# Altium project UWB-Dev-Board.PrjPcb
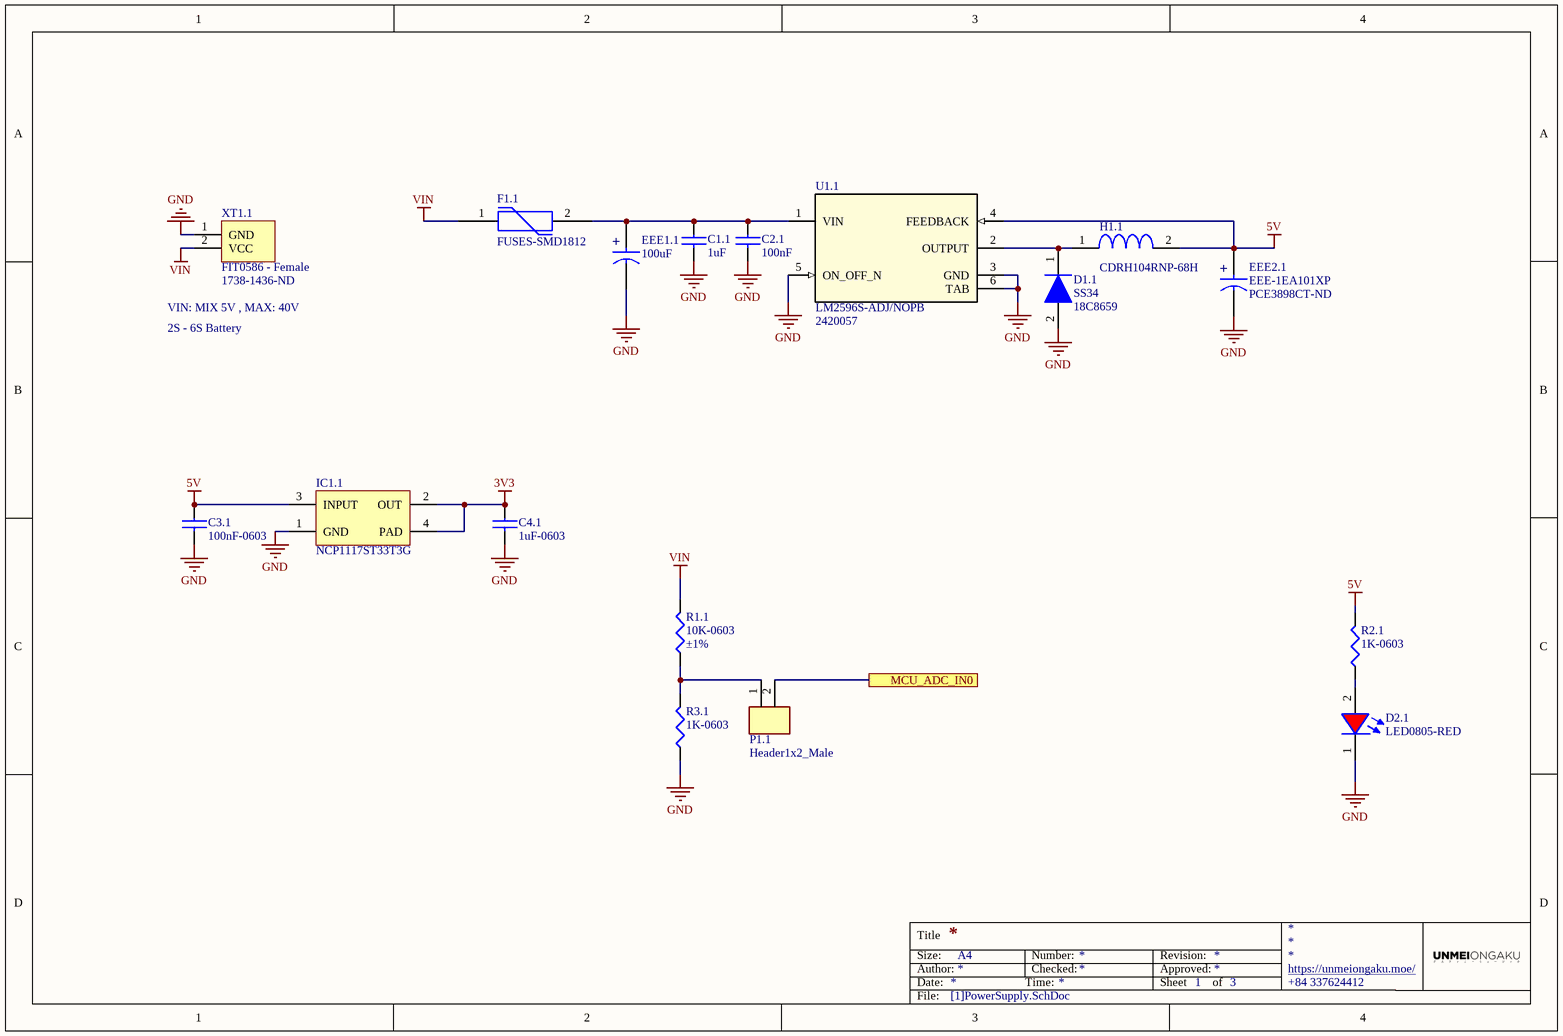
[diagram p0: [1]PowerSupply.SchDoc]
3 sheets, 76 parts. Net scope: flat (ports and power ports of the same name join across sheets).
Board file: UWB-Anchor-DevBoard.PcbDoc
Sheets:
  [1]PowerSupply.SchDoc
  [2] MicroController.SchDoc
  [3] Sensors.SchDoc

## Sheet [1]PowerSupply.SchDoc
size A4; SheetNumber: 1; SheetTotal: 3

### Parts
C1.1  1uF  [CAP0603]
C2.1  100nF  [CAP0603]
C3.1  100nF-0603  [CAP0603]
C4.1  1uF-0603  [CAP0603]
D1.1  SS34  Supplier Part Number 1: 18C8659  [SS34 - 1N5822 / DO-214AA, SMA]
D2.1  LED0805-RED  [LED0805-RED]
EEE1.1  100uF  [CAPACITOR/ALU - SIZE D/SMD - 6.3X5.4]
EEE2.1  EEE-1EA101XP  Supplier Part Number 1: PCE3898CT-ND  [CAPACITOR/ALU - SIZE D8/SMD - 6.3X7.7]
F1.1  FUSES-SMD1812  [FUSES - SMD1812]
H1.1  CDRH104RNP-68H  [CDRH104RNP]
IC1.1  NCP1117ST33T3G  [SOT223-4M_AMS1117_3V3]
P1.1  Header1x2_Male  [HDR1x2_2.54_MALE]
R1.1  10K-0603  Tolerance: ±1%  [RES0603 - 3D]
R2.1  1K-0603  [RES0603 - 3D]
R3.1  1K-0603  [RES0603 - 3D]
U1.1  LM2596S-ADJ/NOPB  Supplier Part Number 1: 2420057  [TO265-5]
XT1.1  FIT0586 - Female  Supplier Part Number 1: 1738-1436-ND  [XT30U-M]

### Ports
MCU_ADC_IN0

### Nets
3V3: C4.1.1 IC1.1.2(OUT) IC1.1.4(PAD)
5V: C3.1.1 EEE2.1.1 H1.1.2 IC1.1.3(INPUT) R2.1.2 U1.1.4(FEEDBACK)
GND: C1.1.2 C2.1.2 C3.1.2 C4.1.2 D1.1.2 D2.1.1(+) EEE1.1.2 EEE2.1.2 IC1.1.1(GND) R3.1.1 U1.1.3(GND) U1.1.5(ON_OFF_N) U1.1.6(TAB) XT1.1.1(GND)
VIN: F1.1.1 R1.1.2 XT1.1.2(VCC)
NetC1.1_1: C1.1.1 C2.1.1 EEE1.1.1 F1.1.2 U1.1.1(VIN)
NetD1.1_1: D1.1.1 H1.1.1 U1.1.2(OUTPUT)
NetD2.1_2: D2.1.2(+) R2.1.1
NetP1.1_1: P1.1.1 R1.1.1 R3.1.2
NetP1.1_2: P1.1.2 ; port MCU_ADC_IN0

### Notes on the sheet
- VIN: MIX 5V , MAX: 40V
- 2S - 6S Battery
- Title
- Size:
- Date:
- Author:
- A4
- Time:
- Number:
- Checked:
- Revision:
- Sheet
- Approved:
- of
- https://unmeiongaku.moe/
- +84 337624412
- File:
- (in symbol EEE-1AA101SP) +
- (in symbol EEE-1EA101XP) +

### Library data of the parts
C1.1 C4.1 = CC0603KRX7R7BB105: CAP CER 1UF 16V X7R 0603; Manufacturer 1: Yageo; Category 1: Capacitors; Capacitance: 1µF; Tolerance: ±10%; Supplier 1: Digi-Key; Supplier Part Number 1: 311-1446-1-ND; Manufacturer Part Number 1: CC0603KRX7R7BB105; RoHS 1: RoHS Compliant; Description 1: CAP CER 1UF 16V X7R 0603; Stock 1: 274580; Pricing 1: 1=0.1, 10=0.051, 100=0.0227, 500=0.0162, 1000=0.01274 (USD); Packaging: Cut Tape (CT); Part Status: Active; Voltage - Rated: 16V; Temperature Coefficient: X7R; Operating Temperature: -55°C ~ 125°C; Features: -; Ratings: -; Applications: General Purpose; Failure Rate: -; Mounting Type: Surface Mount, MLCC; Package / Case: 0603 (1608 Metric); Size / Dimension: 0.063" L x 0.031" W (1.60mm x 0.80mm); Height - Seated (Max): -; Thickness (Max): 0.035" (0.90mm); Lead Spacing: -; Lead Style: -; ComponentLink1URL: http://www.yageo.com/documents/recent/UPY-GPHC_X7R_6.3V-to-50V_18.pdf; ComponentLink1Description: http://www.yageo.com/documents/recent/UPY-GPHC_X7R_6.3V-to-50V_18.pdf; Value: 1uF
C2.1 = CC0603KRX7R9BB104: CAP CER 0.1UF 50V X7R 0603; Manufacturer 1: Yageo; Category 1: Capacitors; Capacitance: 0.1µF; Tolerance: ±10%; Supplier 1: Digi-Key; Supplier Part Number 1: 311-1344-1-ND; Manufacturer Part Number 1: CC0603KRX7R9BB104; RoHS 1: RoHS Compliant; Description 1: CAP CER 0.1UF 50V X7R 0603; Stock 1: 4411645; Pricing 1: 1=0.1, 10=0.031, 100=0.014, 500=0.00998, 1000=0.00783 (USD); Packaging: Cut Tape (CT); Part Status: Active; Voltage - Rated: 50V; Temperature Coefficient: X7R; Operating Temperature: -55°C ~ 125°C; Features: -; Ratings: -; Applications: General Purpose; Failure Rate: -; Mounting Type: Surface Mount, MLCC; Package / Case: 0603 (1608 Metric); Size / Dimension: 0.063" L x 0.031" W (1.60mm x 0.80mm); Height - Seated (Max): -; Thickness (Max): 0.035" (0.90mm); Lead Spacing: -; Lead Style: -; ComponentLink1URL: http://www.yageo.com/documents/recent/UPY-GPHC_X7R_6.3V-to-50V_18.pdf; ComponentLink1Description: http://www.yageo.com/documents/recent/UPY-GPHC_X7R_6.3V-to-50V_18.pdf; Value: 100nF
C3.1 = CC0603KRX7R9BB104: CAP CER 0.1UF 50V X7R 0603; Manufacturer 1: Yageo; Category 1: Capacitors; Capacitance: 0.1µF; Tolerance: ±10%; Value: 100nF; Supplier 1: Digi-Key; Supplier Part Number 1: 311-1344-1-ND; Manufacturer Part Number 1: CC0603KRX7R9BB104; RoHS 1: RoHS Compliant; Description 1: CAP CER 0.1UF 50V X7R 0603; Stock 1: 4411645; Pricing 1: 1=0.1, 10=0.031, 100=0.014, 500=0.00998, 1000=0.00783 (USD); Packaging: Cut Tape (CT); Part Status: Active; Voltage - Rated: 50V; Temperature Coefficient: X7R; Operating Temperature: -55°C ~ 125°C; Features: -; Ratings: -; Applications: General Purpose; Failure Rate: -; Mounting Type: Surface Mount, MLCC; Package / Case: 0603 (1608 Metric); Size / Dimension: 0.063" L x 0.031" W (1.60mm x 0.80mm); Height - Seated (Max): -; Thickness (Max): 0.035" (0.90mm); Lead Spacing: -; Lead Style: -; ComponentLink1URL: http://www.yageo.com/documents/recent/UPY-GPHC_X7R_6.3V-to-50V_18.pdf; ComponentLink1Description: http://www.yageo.com/documents/recent/UPY-GPHC_X7R_6.3V-to-50V_18.pdf
D1.1 = SS34: SS Series 500 mV 3 A 40 V Max Reverse Voltage Schottky Rectifier - DO-214AB; Manufacturer: ON Semiconductor / Fairchild; Number of Terminals/Pins: 2; Package Body Material: Plastic; Diode Element Material: SILICON; Forward Current: 3A; Element Configuration: Single; Max Repetitive Reverse Voltage (Vrrm): 40V; Forward Voltage: 500mV; Max Forward Surge Current (Ifsm): 100A; Polarity: Standard; Max Reverse Current: 500uA; Number of Elements: 1; Max Power Dissipation: 2.27W; Supplier 1: Newark; Manufacturer Part Number: SS34; RoHS: Yes; Category: Schottky Diodes; Stock 1: 7040; Pricing 1: 1=0.65000, 25=0.57600, 50=0.50900, 100=0.44100, 250=0.39500, 500=0.34900, 1000=0.27900 (USD); Mount: Surface Mount; Case/Package: SMC; Number of Pins: 2; Contact Plating: Tin,Matte; Package Shape: Rectangular; Terminal Finish: Tin; Min Operating Temperature: -55°C; Max Operating Temperature: 150°C; Packaging: Tape and Reel; Voltage Rating (DC): 40V; Current Rating: 3A; Output Current: 3A; Max Surge Current: 100A; Package Quantity: 1; Max Reverse Leakage Current: 500uA; Peak Non-Repetitive Surge Current: 100A; Current: 3A; Voltage: 40V; Average Rectified Current: 3A; Max Reverse Voltage (DC): 40V; Series: -; Moisture Sensitivity Level: 1; JESD-30 Code: R-PDSO-C2; Peak Reflow Temperature (Cel): 260°C; Surface Mount: Yes; Terminal Position: DUAL; Technology: SCHOTTKY; Number of Phases: 1; Terminal Form: C BEND; Length: 7.15mm; Width: 6.25mm; Height: 2.75mm; Radiation Hardening: No; RoHS Compliant: Yes; Reach SVHC Compliant: Yes; Lead Free: Lead Free; JEDEC-95 Code: DO-214AB
EEE1.1 = EEE-1AA101SP: Cap Aluminum 100uF 10V 20% (6.3 X 5.4mm) SMD 70mA 2000 hr 85°C T/R; Manufacturer: Panasonic; Polarity: Polar; Life (Hours): 2000Hour; Leakage Current: 3uA; Supplier 1: Digi-Key; Manufacturer Part Number: EEE-1AA101SP; RoHS: Yes; Category: Aluminum Electrolytic Capacitors; Pricing 1: 1=0.38000, 10=0.26400, 50=0.18520, 100=0.15870, 500=0.11902 (USD); Mount: Surface Mount,PCB; Case/Package: Radial; Contact Plating: Tin; Min Operating Temperature: -40°C; Max Operating Temperature: 85°C; Packaging: Tape and Reel; Capacitance: 100uF; Tolerance: 20%; Ripple Current: 70mA; Voltage Rating: 10V; Package Quantity: 1000; Voltage Rating (DC): 10V; Termination: SMD/SMT; Ripple Current (AC): 70mA; Voltage: 10V; Features: General Purpose; Series: S; Construction: Cylindrical; Diameter: 6.3mm; Length: 5.5mm; Height: 5.4mm; Height - Seated (Max): 0.213inch; Radiation Hardening: No; Lead Free: Lead Free; RoHS Compliant: Yes; REACH SVHC: Unknown; ComponentLink1URL: https://datasheet.ciiva.com/43470/aba0000ce2-43470621.pdf?src-supplier=Farnell; ComponentLink1Description: https://datasheet.ciiva.com/43470/aba0000ce2-43470621.pdf?src-supplier=Farnell; ComponentLink2URL: https://datasheet.ciiva.com/46378/aba0000ce2-46378266.pdf?src-supplier=Element14; ComponentLink2Description: https://datasheet.ciiva.com/46378/aba0000ce2-46378266.pdf?src-supplier=Element14; ComponentLink3URL: https://datasheet.ciiva.com/31414/aba0000ce2-31414629.pdf?src-supplier=Farnell; ComponentLink3Description: https://datasheet.ciiva.com/31414/aba0000ce2-31414629.pdf?src-supplier=Farnell; ComponentLink4URL: https://datasheet.ciiva.com/46374/aba0000ce2-46374349.pdf?src-supplier=Element14; ComponentLink4Description: https://datasheet.ciiva.com/46374/aba0000ce2-46374349.pdf?src-supplier=Element14; ComponentLink5URL: https://datasheet.ciiva.com/14598/70255710-14598444.pdf?src-supplier=Allied+Electronics; ComponentLink5Description: https://datasheet.ciiva.com/14598/70255710-14598444.pdf?src-supplier=Allied+Electronics; ComponentLink6URL: https://datasheet.ciiva.com/14604/70255710-14604862.pdf?src-supplier=Allied+Electronics; ComponentLink6Description: https://datasheet.ciiva.com/14604/70255710-14604862.pdf?src-supplier=Allied+Electronics; ComponentLink7URL: https://datasheet.ciiva.com/2983/aba0000ce2-2983905.pdf?src-supplier=Avnet; ComponentLink7Description: https://datasheet.ciiva.com/2983/aba0000ce2-2983905.pdf?src-supplier=Avnet; ComponentLink8URL: https://datasheet.ciiva.com/15166/getdatasheetpartid-178534-15166250.pdf?src-supplier=Verical; ComponentLink8Description: https://datasheet.ciiva.com/15166/getdatasheetpartid-178534-15166250.pdf?src-supplier=Verical; ComponentLink9URL: https://datasheet.ciiva.com/2985/aba0000ce2-2985040.pdf?src-supplier=Avnet; ComponentLink9Description: https://datasheet.ciiva.com/2985/aba0000ce2-2985040.pdf?src-supplier=Avnet; ComponentLink10URL: https://datasheet.ciiva.com/30099/11aba0000ce2-30099766.pdf?src-supplier=Onlinecomponents.com; ComponentLink10Description: https://datasheet.ciiva.com/30099/11aba0000ce2-30099766.pdf?src-supplier=Onlinecomponents.com; ComponentLink11URL: https://datasheet.ciiva.com/17536/aba0000ce2-17536070.pdf?src-supplier=Avnet+Europe; ComponentLink11Description: https://datasheet.ciiva.com/17536/aba0000ce2-17536070.pdf?src-supplier=Avnet+Europe; Supplier Part Number 1: PCE3866DKR-ND
EEE2.1 = EEE-1EA101XP: Cap Aluminum 100uF 25V 20% (6.3 X 7.7mm) SMD 143mA 2000h 85°C T/R; Manufacturer: Panasonic; Polarity: Polar; Life (Hours): 2000Hour; Leakage Current: 3uA; Supplier 1: Digi-Key; Manufacturer Part Number: EEE-1EA101XP; RoHS: Yes; Category: Aluminum Electrolytic Capacitors; Pricing 1: 1=0.52000, 10=0.36100, 50=0.25240, 100=0.21630 (USD); Mount: Surface Mount,PCB; Case/Package: Radial; Contact Plating: Tin; Min Operating Temperature: -40°C; Max Operating Temperature: 85°C; Capacitance: 100uF; Tolerance: 20%; Voltage Rating (DC): 25V; Ripple Current: 143mA; Packaging: Tape and Reel; Voltage Rating: 25V; Package Quantity: 900; Termination: SMD/SMT; Ripple Current (AC): 143mA; Voltage: 25V; Series: S; Construction: Cylindrical; Diameter: 6.3mm; Length: 8mm; Height: 7.7mm; Height - Seated (Max): 0.303inch; Radiation Hardening: No; Lead Free: Lead Free; RoHS Compliant: Yes; REACH SVHC: Unknown; ComponentLink1URL: https://datasheet.ciiva.com/24022/aba0000ce2-40801-24022875.pdf?src-supplier=Mouser; ComponentLink1Description: https://datasheet.ciiva.com/24022/aba0000ce2-40801-24022875.pdf?src-supplier=Mouser; ComponentLink2URL: https://datasheet.ciiva.com/16201/aba0000ce2-16201065.pdf?src-supplier=Future+Electronics; ComponentLink2Description: https://datasheet.ciiva.com/16201/aba0000ce2-16201065.pdf?src-supplier=Future+Electronics; ComponentLink3URL: https://datasheet.ciiva.com/30108/11aba0000ce2-30108047.pdf?src-supplier=Onlinecomponents.com; ComponentLink3Description: https://datasheet.ciiva.com/30108/11aba0000ce2-30108047.pdf?src-supplier=Onlinecomponents.com; ComponentLink4URL: https://datasheet.ciiva.com/17529/aba0000ce2-17529557.pdf?src-supplier=Avnet+Europe; ComponentLink4Description: https://datasheet.ciiva.com/17529/aba0000ce2-17529557.pdf?src-supplier=Avnet+Europe
H1.1 = CDRH104RNP-680NC: Ind Power Shielded Wirewound 68uH 30% 100KHz Ferrite 1.42A Carrier T/R; Manufacturer: Sumida; Saturation Current: 1.5A; DC Resistance (DCR): 213mR; Supplier 1: Digi-Key; Manufacturer Part Number: CDRH104RNP-680NC; RoHS: Yes; Category: Fixed Inductors; Stock 1: 26557; Pricing 1: 1=1.78000, 10=1.64700, 25=1.51000, 50=1.29060, 100=1.15320, 250=0.98848, 500=0.93356 (USD); Mount: Surface Mount; Case/Package: Nonstandard; Core Material: Ferrite; Min Operating Temperature: -40°C; Max Operating Temperature: 100°C; Package Quantity: 1000; Current Rating: 1.42A; Tolerance: 30%; Shielding: Shielded; Packaging: Tape and Reel; Inductance: 68uH; Test Frequency: 100kHz; Max DC Current: 1.42A; Termination: SMD/SMT; Series: CDRH; Rated Current-Max: 1.5A; Length: 0.402inch; Width: 0.405inch; Height: 4mm; Height - Seated (Max): 0.157inch; Depth: 10.3mm; Radiation Hardening: No; Lead Free: Lead Free; RoHS Compliant: Yes; ComponentLink1URL: http://www.sumida.com/products/pdf/CDRH104,104R.pdf?src-supplier=Digi-Key; ComponentLink1Description: http://www.sumida.com/products/pdf/CDRH104,104R.pdf?src-supplier=Digi-Key; ComponentLink2URL: http://products.sumida.com/products/pdf/CDRH104R.pdf?src-supplier=Digi-Key; ComponentLink2Description: http://products.sumida.com/products/pdf/CDRH104R.pdf?src-supplier=Digi-Key; ComponentLink3URL: http://www.sumida.com/products/pdf/CDRH104,104R.pdf?src-supplier=Mouser; ComponentLink3Description: http://www.sumida.com/products/pdf/CDRH104,104R.pdf?src-supplier=Mouser; ComponentLink4URL: http://www.sumida.com/products/pdf/CDRH104R.pdf?src-supplier=Avnet; ComponentLink4Description: http://www.sumida.com/products/pdf/CDRH104R.pdf?src-supplier=Avnet; ComponentLink5URL: http://www.sumida.com/products/pdf/CDRH104,104R.pdf?src-supplier=Future+Electronics; ComponentLink5Description: http://www.sumida.com/products/pdf/CDRH104,104R.pdf?src-supplier=Future+Electronics; Supplier Part Number 1: 308-2170-1-ND
IC1.1 = AMS1117 - 3V3: LDO Voltage Regulators 3.3V 1A Positive; Manufacturer: ON Semiconductor; Input Voltage MAX: 20 V; Number of Outputs: 1 Output; Output Type: Fixed; Quiescent Current: 10 mA; Dropout Voltage - Max: 1.1 V at 100 mA; Voltage Regulation Accuracy: 1 %; Dropout Voltage: 0.95 V at 100 mA; Ib - Input Bias Current: 6 mA; Line Regulation: 0.8 mV; Load Regulation: 4.3 mV; Supplier 1: Mouser; Manufacturer Part Number: NCP1117ST33T3G; RoHS: RoHS Compliant; Category: LDO Voltage Regulators; Stock 1: 0; Pricing 1: 1=0.450, 10=0.366, 100=0.223, 1000=0.173, 4000=0.147, 8000=0.137, 24000=0.130, 48000=0.127 (USD); Height: 1.69 mm (Max); Length: 6.7 mm (Max); Output Current: 1 A; Output Voltage: 3.3 V; Package / Case: SOT-223-3; Packaging: Cut Tape; Series: NCP1117; Width: 3.7 mm (Max); Brand: ON Semiconductor; Mounting Style: SMD/SMT; Maximum Operating Temperature: + 125 C; Minimum Operating Temperature: 0 C; Polarity: Positive; Standard Pack Qty: 4000; RoHS - Mouser: Y; Minimum Order Quantity: 1; Reeling: True; ComponentLink1URL: https://www.mouser.com/ds/2/308/NCP1117-D-81326.pdf; ComponentLink1Description: https://www.mouser.com/ds/2/308/NCP1117-D-81326.pdf; Supplier Part Number 1: 863-NCP1117ST33T3G
P1.1 = HDR1x2_2.54_MALE: Header1x2_2.54_MALE
R1.1 = RC0603FR-0710KL: RES SMD 10K OHM 1% 1/10W 0603; Manufacturer: Yageo; Power (Watts): 0.1W, 1/10W; Temperature Coefficient: ±100ppm/°C; Supplier 1: Digi-Key; Manufacturer Part Number: RC0603FR-0710KL; RoHS: RoHS Compliant; Category: Resistors; Stock 1: 16545228; Pricing 1: 1=0.1, 10=0.015, 100=0.006, 1000=0.00268, 2500=0.00233 (USD); Packaging: Cut Tape (CT); Part Status: Active; Composition: Thick Film; Features: Moisture Resistant; Operating Temperature: -55°C ~ 155°C; Package / Case: 0603 (1608 Metric); Supplier Device Package: 0603; Size / Dimension: 0.063" L x 0.032" W (1.60mm x 0.80mm); Height - Seated (Max): 0.022" (0.55mm); Failure Rate: -; ComponentLink1URL: http://www.yageo.com/documents/recent/PYu-RC_Group_51_RoHS_L_7.pdf; ComponentLink1Description: http://www.yageo.com/documents/recent/PYu-RC_Group_51_RoHS_L_7.pdf; Supplier Part Number 1: 311-10.0KHRCT-ND; Value: 10K
R2.1 R3.1 = RC0603JR-071KL: RES SMD 1K OHM 5% 1/10W 0603; Manufacturer 1: Yageo; Category 1: Resistors; Power (Watts): 0.1W, 1/10W; Temperature Coefficient: ±100ppm/°C; Supplier 1: Digi-Key; Supplier Part Number 1: 311-1.0KGRCT-ND; Manufacturer Part Number 1: RC0603JR-071KL; RoHS 1: RoHS Compliant; Description 1: RES SMD 1K OHM 5% 1/10W 0603; Stock 1: 2853955; Pricing 1: 1=0.1, 10=0.011, 100=0.0044, 1000=0.00198, 2500=0.00172 (USD); Packaging: Cut Tape (CT); Part Status: Active; Resistance (Ohms): 1k; Tolerance: ±5%; Composition: Thick Film; Features: Moisture Resistant; Operating Temperature: -55°C ~ 155°C; Package / Case: 0603 (1608 Metric); Supplier Device Package: 0603; Size / Dimension: 0.063" L x 0.031" W (1.60mm x 0.80mm); Height - Seated (Max): 0.022" (0.55mm); Failure Rate: -; ComponentLink1URL: http://www.yageo.com/documents/recent/PYu-RC_Group_51_RoHS_L_7.pdf; ComponentLink1Description: http://www.yageo.com/documents/recent/PYu-RC_Group_51_RoHS_L_7.pdf; Value: 1K
U1.1 = LM2596S-ADJ/NOPB: Optoisolator 5KV Trans 4SMD / Optocoupler Dc-in 1-CH Transistor Dc-out 4-PIN PDIP SMD; Mfr_Name: Texas Instruments; PartNumber: LM2596SX-ADJ/NOPB; Manufacturer Part Number: PC817XNNIP0F; CompType: IC; Reverse Breakdown Voltage: 6V; Forward Voltage: 1.4V; Forward Current: 50mA; Rise Time: 18000ns; Collector Emitter Voltage (VCEO): 80V; Collector Emitter Saturation Voltage: 200mV; Number of Elements: 1; Power Dissipation: 200mW; Input Type: DC; Output Current per Channel: 30mA; Type: DEV; RefDes: RefDes; Copyright: Copyright (C) 2021 Ultra Librarian. All rights reserved.; Manufacturer_Part_Number: LM2596S-ADJ/NOPB; Alternate_PartNumber: LM2596S-ADJ/NOPB; PackageReference: KTT0005B; MountType: SMT; RoHS: Y; Manufacturer: Texas Instruments; Supplier 1: Farnell; Category: Optocouplers; Pricing 1: 1=0.31700, 25=0.29900, 100=0.21300, 250=0.17700, 500=0.14100, 2000=0.13800 (GBP); Mount: Surface Mount; Case/Package: SMD/SMT; Number of Pins: 4; Contact Plating: Copper,Tin; Min Operating Temperature: -30°C; Max Operating Temperature: 100°C; Fall Time: 18000ns; Packaging: Tape and Reel; Max Power Dissipation: 200mW; Package Quantity: 2000; Number of Channels: 1; Output Voltage: 80V; Max Input Current: 50mA; Max Collector Current: 50mA; Isolation Voltage: 5kV; Input Current: 50mA; Collector-emitter Voltage-Max: 200mV; Max Output Voltage: 80V; Isolation Voltage-Max: 5kV; Radiation Hardening: No; RoHS Compliant: Yes; Lead Free: Lead Free; ComponentLink1URL: https://datasheet.ciiva.com/15119/getdatasheetpartid-299374-15119023.pdf?src-supplier=Verical; ComponentLink1Description: https://datasheet.ciiva.com/15119/getdatasheetpartid-299374-15119023.pdf?src-supplier=Verical; ComponentLink2URL: https://datasheet.ciiva.com/2086/pc817xxnip0f-series-2086508.pdf?src-supplier=Digi-Key; ComponentLink2Description: https://datasheet.ciiva.com/2086/pc817xxnip0f-series-2086508.pdf?src-supplier=Digi-Key; ComponentLink3URL: https://datasheet.ciiva.com/2086/pc817xxnip0f-series-2086507.pdf?src-supplier=Digi-Key; ComponentLink3Description: https://datasheet.ciiva.com/2086/pc817xxnip0f-series-2086507.pdf?src-supplier=Digi-Key; ComponentLink4URL: https://datasheet.ciiva.com/2086/pc817xxnip0f-series-2086509.pdf?src-supplier=Digi-Key; ComponentLink4Description: https://datasheet.ciiva.com/2086/pc817xxnip0f-series-2086509.pdf?src-supplier=Digi-Key; ComponentLink5URL: https://datasheet.ciiva.com/46396/1812378-46396954.pdf?src-supplier=Element14; ComponentLink5Description: https://datasheet.ciiva.com/46396/1812378-46396954.pdf?src-supplier=Element14; ComponentLink6URL: https://datasheet.ciiva.com/46435/1812378-46435723.pdf?src-supplier=Element14; ComponentLink6Description: https://datasheet.ciiva.com/46435/1812378-46435723.pdf?src-supplier=Element14; ComponentLink7URL: https://datasheet.ciiva.com/16475/pc817xnnip0f-16475911.pdf?src-supplier=Future+Electronics; ComponentLink7Description: https://datasheet.ciiva.com/16475/pc817xnnip0f-16475911.pdf?src-supplier=Future+Electronics
XT1.1 = FIT0586 - Female: High Quality Gold Plated Male and Female Bullet Connector; Manufacturer: DFRobot; Supplier 1: Digikey; Manufacturer Part Number: FIT0586; RoHS: No; Category: Uncategorized; Stock 1: 818; Pricing 1: 1=1.9 (USD); ComponentLink1URL: https://media.digikey.com/pdf/Data%20Sheets/DFRobot%20PDFs/FIT0586_Web.pdf?src-supplier=Digikey; ComponentLink1Description: https://media.digikey.com/pdf/Data%20Sheets/DFRobot%20PDFs/FIT0586_Web.pdf?src-supplier=Digikey

## Sheet [2] MicroController.SchDoc
size A4; SheetNumber: 2; SheetTotal: 3
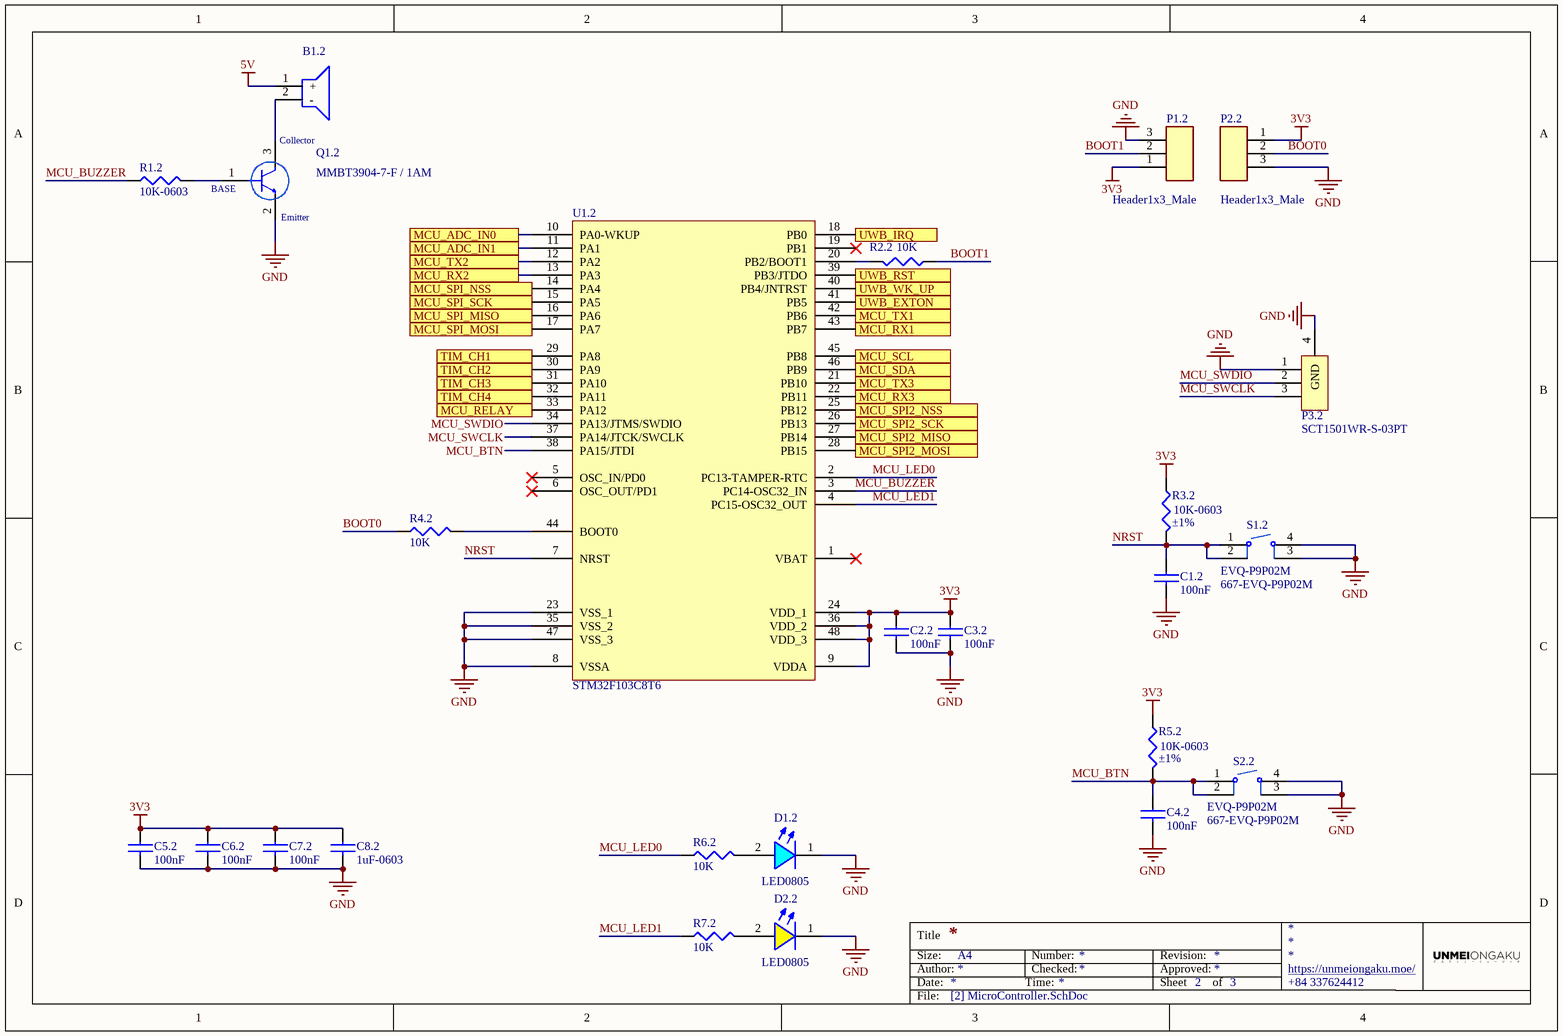
[diagram p1: [2] MicroController.SchDoc]

### Parts
B1.2  Buzzer  [Buzzer 9x5mm 60dB]  (value not drawn)
C1.2  100nF  [CAP0603]
C2.2  100nF  [CAP0603]
C3.2  100nF  [CAP0603]
C4.2  100nF  [CAP0603]
C5.2  100nF  [CAP0603]
C6.2  100nF  [CAP0603]
C7.2  100nF  [CAP0603]
C8.2  1uF-0603  [CAP0603]
D1.2  LED0805  [LED0805-BLUE]
D2.2  LED0805  [LED0805-YELLOW]
P1.2  Header1x3_Male  [HDR1x3_2.54_MALE]
P2.2  Header1x3_Male  [HDR1x3_2.54_MALE]
P3.2  SCT1501WR-S-03PT  [Connector ZH1.5 3P SMD]
Q1.2  MMBT3904-7-F / 1AM  [SOT23]
R1.2  10K-0603  [RES0603 - 3D]
R2.2  10K  [RES0603 - 3D]
R3.2  10K-0603  Tolerance: ±1%  [RES0603 - 3D]
R4.2  10K  [RES0603 - 3D]
R5.2  10K-0603  Tolerance: ±1%  [RES0603 - 3D]
R6.2  10K  [RES0603 - 3D]
R7.2  10K  [RES0603 - 3D]
S1.2  EVQ-P9P02M  Supplier Part Number 1: 667-EVQ-P9P02M  [TactileSwitch,SMT,4.2x3.2x2.5mm,4N]
S2.2  EVQ-P9P02M  Supplier Part Number 1: 667-EVQ-P9P02M  [TactileSwitch,SMT,4.2x3.2x2.5mm,4N]
U1.2  STM32F103C8T6  [LQFP48_L]

### Ports
MCU_ADC_IN0, MCU_ADC_IN1, MCU_RELAY, MCU_RX1, MCU_RX2, MCU_RX3, MCU_SCL, MCU_SDA, MCU_SPI2_MISO, MCU_SPI2_MOSI, MCU_SPI2_NSS, MCU_SPI2_SCK, MCU_SPI_MISO, MCU_SPI_MOSI, MCU_SPI_NSS, MCU_SPI_SCK, MCU_TX1, MCU_TX2, MCU_TX3, TIM_CH1, TIM_CH2, TIM_CH3, TIM_CH4, UWB_EXTON, UWB_IRQ, UWB_RST, UWB_WK_UP

### Nets
3V3: C2.2.1 C3.2.1 C5.2.1 C6.2.1 C7.2.1 C8.2.1 P1.2.1 P2.2.1 R3.2.1 R5.2.1 U1.2.9(VDDA) U1.2.24(VDD_1) U1.2.36(VDD_2) U1.2.48(VDD_3)
5V: B1.2.1(+)
GND: C1.2.2 C2.2.2 C3.2.2 C4.2.2 C5.2.2 C6.2.2 C7.2.2 C8.2.2 D1.2.1(+) D2.2.1(+) P1.2.3 P2.2.3 P3.2.1 P3.2.4(GND) Q1.2.2 S1.2.3 S1.2.4 S2.2.3 S2.2.4 U1.2.8(VSSA) U1.2.23(VSS_1) U1.2.35(VSS_2) U1.2.47(VSS_3)
BOOT0: P2.2.2 R4.2.1
BOOT1: P1.2.2 R2.2.1
MCU_BTN: C4.2.1 R5.2.2 S2.2.1 S2.2.2 U1.2.38(PA15/JTDI)
MCU_BUZZER: R1.2.1 U1.2.3(PC14-OSC32_IN)
MCU_LED0: R6.2.1 U1.2.2(PC13-TAMPER-RTC)
MCU_LED1: R7.2.1 U1.2.4(PC15-OSC32_OUT)
MCU_SWCLK: P3.2.3 U1.2.37(PA14/JTCK/SWCLK)
MCU_SWDIO: P3.2.2 U1.2.34(PA13/JTMS/SWDIO)
NRST: C1.2.1 R3.2.2 S1.2.1 S1.2.2 U1.2.7(NRST)
NetB1.2_2: B1.2.2(-) Q1.2.3
NetD1.2_2: D1.2.2(+) R6.2.2
NetD2.2_2: D2.2.2(+) R7.2.2
NetIC1.3_5: U1.2.46(PB9) ; port MCU_SDA
NetIC1.3_6: U1.2.45(PB8) ; port MCU_SCL
NetP1.1_2: U1.2.10(PA0-WKUP) ; port MCU_ADC_IN0
NetP1.3_1: U1.2.29(PA8) ; port TIM_CH1
NetP1.3_2: U1.2.30(PA9) ; port TIM_CH2
NetP1.3_3: U1.2.31(PA10) ; port TIM_CH3
NetP1.3_4: U1.2.32(PA11) ; port TIM_CH4
NetP2.3_2: U1.2.21(PB10) ; port MCU_TX3
NetP2.3_3: U1.2.22(PB11) ; port MCU_RX3
NetP3.3_2: U1.2.11(PA1) ; port MCU_ADC_IN1
NetP4.3_2: U1.2.42(PB6) ; port MCU_TX1
NetP4.3_3: U1.2.43(PB7) ; port MCU_RX1
NetP6.3_4: U1.2.33(PA12) ; port MCU_RELAY
NetP7.3_2: U1.2.12(PA2) ; port MCU_TX2
NetP7.3_3: U1.2.13(PA3) ; port MCU_RX2
NetP8.3_1: U1.2.25(PB12) ; port MCU_SPI2_NSS
NetP8.3_2: U1.2.26(PB13) ; port MCU_SPI2_SCK
NetP8.3_3: U1.2.27(PB14) ; port MCU_SPI2_MISO
NetP8.3_4: U1.2.28(PB15) ; port MCU_SPI2_MOSI
NetQ1.2_1: Q1.2.1 R1.2.2
NetR2.2_2: R2.2.2 U1.2.20(PB2/BOOT1)
NetR4.2_2: R4.2.2 U1.2.44(BOOT0)
NetR9.3_2: U1.2.39(PB3/JTDO) ; port UWB_RST
NetR10.3_2: U1.2.40(PB4/JNTRST) ; port UWB_WK_UP
NetR11.3_2: U1.2.41(PB5) ; port UWB_EXTON
NetR12.3_2: U1.2.18(PB0) ; port UWB_IRQ
NetU1.2_14: U1.2.14(PA4) ; port MCU_SPI_NSS
NetU1.2_15: U1.2.15(PA5) ; port MCU_SPI_SCK
NetU1.2_16: U1.2.16(PA6) ; port MCU_SPI_MISO
NetU1.2_17: U1.2.17(PA7) ; port MCU_SPI_MOSI

Not connected (* = marked no-connect by the designer): U1.2 1(VBAT)* 5(OSC_IN/PD0)* 6(OSC_OUT/PD1)* 19(PB1)*

### Notes on the sheet
- Title
- Size:
- Date:
- Author:
- A4
- Time:
- Number:
- Checked:
- Revision:
- Sheet
- Approved:
- of
- https://unmeiongaku.moe/
- +84 337624412
- File:
- (in symbol MMBT3904-7-F / 1AM) Collector; BASE; Emitter

### Library data of the parts
B1.2 = Buzzer 9050 - DIP: 9050 DIP Buzzer 9x5mm 60dB; Local Supplier: thegioiic; Local Supplier Link: https://www.thegioiic.com/products/1209-dip-buzzer-12x9mm; Local Supplier Part Number: 1209 DIP Buzzer 12x9mm
C1.2 C2.2 C3.2 C4.2 C5.2 C6.2 C7.2 = CC0603KRX7R9BB104: as C2.1 on sheet [1]PowerSupply; Supplier 1: Digi-Key; Supplier Part Number 1: 311-1344-1-ND; Manufacturer Part Number 1: CC0603KRX7R9BB104; RoHS 1: RoHS Compliant; Description 1: CAP CER 0.1UF 50V X7R 0603; Stock 1: 4411645; Pricing 1: 1=0.1, 10=0.031, 100=0.014, 500=0.00998, 1000=0.00783 (USD); Packaging: Cut Tape (CT); Part Status: Active; Voltage - Rated: 50V; Temperature Coefficient: X7R; Operating Temperature: -55°C ~ 125°C; Features: -; Ratings: -; Applications: General Purpose; Failure Rate: -; Mounting Type: Surface Mount, MLCC; Package / Case: 0603 (1608 Metric); Size / Dimension: 0.063" L x 0.031" W (1.60mm x 0.80mm); Height - Seated (Max): -; Thickness (Max): 0.035" (0.90mm); Lead Spacing: -; Lead Style: -; ComponentLink1URL: http://www.yageo.com/documents/recent/UPY-GPHC_X7R_6.3V-to-50V_18.pdf; ComponentLink1Description: http://www.yageo.com/documents/recent/UPY-GPHC_X7R_6.3V-to-50V_18.pdf; Value: 100nF
C8.2 = CC0603KRX7R7BB105: as C1.1 on sheet [1]PowerSupply; Supplier 1: Digi-Key; Supplier Part Number 1: 311-1446-1-ND; Manufacturer Part Number 1: CC0603KRX7R7BB105; RoHS 1: RoHS Compliant; Description 1: CAP CER 1UF 16V X7R 0603; Stock 1: 274580; Pricing 1: 1=0.1, 10=0.051, 100=0.0227, 500=0.0162, 1000=0.01274 (USD); Packaging: Cut Tape (CT); Part Status: Active; Voltage - Rated: 16V; Temperature Coefficient: X7R; Operating Temperature: -55°C ~ 125°C; Features: -; Ratings: -; Applications: General Purpose; Failure Rate: -; Mounting Type: Surface Mount, MLCC; Package / Case: 0603 (1608 Metric); Size / Dimension: 0.063" L x 0.031" W (1.60mm x 0.80mm); Height - Seated (Max): -; Thickness (Max): 0.035" (0.90mm); Lead Spacing: -; Lead Style: -; ComponentLink1URL: http://www.yageo.com/documents/recent/UPY-GPHC_X7R_6.3V-to-50V_18.pdf; ComponentLink1Description: http://www.yageo.com/documents/recent/UPY-GPHC_X7R_6.3V-to-50V_18.pdf; Value: 1uF
D1.2 = LED0805-BLUE
D2.2 = LED0805-YELLOW
P1.2 P2.2 = HDR1x3_2.54_MALE: Header1x3_2.54_MALE
Q1.2 = MMBT3904-7-F / 1AM: Transistor General Purpose BJT NPN 40 Volt 0.2A Automotive 3-Pin SOT-23; Manufacturer: Diodes Zetex; Collector Emitter Breakdown Voltage: 40V; Max Power Dissipation: 300mW; Max Collector Current: 200mA; Transition Frequency: 300MHz; Collector Base Voltage (VCBO): 60V; Emitter Base Voltage (VEBO): 6V; Collector Emitter Saturation Voltage: 300mV; Element Configuration: Single; hFE Min: 100; Power Dissipation: 350mW; Number of Elements: 1; Supplier 1: Digi-Key; Manufacturer Part Number: MMBT3904-7-F; RoHS: Yes; Category: BJTs; Stock 1: 468030; Pricing 1: 3000=0.02271, 6000=0.02048, 15000=0.01781, 30000=0.01603, 75000=0.01425 (USD); Mount: Surface Mount; Case/Package: SOT-23; Number of Pins: 3; Contact Plating: Tin,Matte; Weight: 0.000282oz; Min Operating Temperature: -55°C; Max Operating Temperature: 150°C; Packaging: Tape and Reel; Polarity: NPN; Package Quantity: 3000; Collector Emitter Voltage (VCEO): 40V; Gain Bandwidth Product: 300MHz; Frequency: 300MHz; Max Breakdown Voltage: 40V; Series: -; Collector-emitter Voltage-Max: 300mV; Voltage Rating (DC): 40V; Max Frequency: 300MHz; Continuous Collector Current: 200mA; Length: 3.05mm; Width: 1.4mm; Height: 1mm; Radiation Hardening: No; RoHS Compliant: Yes; Lead Free: Lead Free; REACH SVHC: No SVHC; ComponentLink1URL: https://datasheet.ciiva.com/11201/ds30036-11201778.pdf?src-supplier=Avnet; ComponentLink1Description: https://datasheet.ciiva.com/11201/ds30036-11201778.pdf?src-supplier=Avnet; ComponentLink2URL: https://datasheet.ciiva.com/15138/getdatasheetpartid-53265-15138780.pdf?src-supplier=Verical; ComponentLink2Description: https://datasheet.ciiva.com/15138/getdatasheetpartid-53265-15138780.pdf?src-supplier=Verical; ComponentLink3URL: https://datasheet.ciiva.com/22711/1915516-22711750.pdf?src-supplier=Element14; ComponentLink3Description: https://datasheet.ciiva.com/22711/1915516-22711750.pdf?src-supplier=Element14; ComponentLink4URL: https://datasheet.ciiva.com/11198/ds30036-11198999.pdf?src-supplier=Avnet; ComponentLink4Description: https://datasheet.ciiva.com/11198/ds30036-11198999.pdf?src-supplier=Avnet; ComponentLink5URL: https://datasheet.ciiva.com/6361/ds30036-6361256.pdf?src-supplier=Digi-Key; ComponentLink5Description: https://datasheet.ciiva.com/6361/ds30036-6361256.pdf?src-supplier=Digi-Key; ComponentLink6URL: https://datasheet.ciiva.com/6361/ds30036-6361254.pdf?src-supplier=Digi-Key; ComponentLink6Description: https://datasheet.ciiva.com/6361/ds30036-6361254.pdf?src-supplier=Digi-Key; Supplier Part Number 1: MMBT3904-FDITR-ND
R1.2 = RC0603JR-0710KL: RES SMD 10K OHM 5% 1/10W 0603; Manufacturer 1: Yageo; Category 1: Resistors; Power (Watts): 0.1W, 1/10W; Temperature Coefficient: ±100ppm/°C; Supplier 1: Digi-Key; Supplier Part Number 1: 311-10KGRCT-ND; Manufacturer Part Number 1: RC0603JR-0710KL; RoHS 1: RoHS Compliant; Description 1: RES SMD 10K OHM 5% 1/10W 0603; Stock 1: 3056463; Pricing 1: 1=0.1, 10=0.011, 100=0.0044, 1000=0.00198, 2500=0.00172 (USD); Packaging: Cut Tape (CT); Part Status: Active; Resistance (Ohms): 10k; Tolerance: ±5%; Composition: Thick Film; Features: Moisture Resistant; Operating Temperature: -55°C ~ 155°C; Package / Case: 0603 (1608 Metric); Supplier Device Package: 0603; Size / Dimension: 0.063" L x 0.031" W (1.60mm x 0.80mm); Height - Seated (Max): 0.022" (0.55mm); Failure Rate: -; ComponentLink1URL: http://www.yageo.com/documents/recent/PYu-RC_Group_51_RoHS_L_7.pdf; ComponentLink1Description: http://www.yageo.com/documents/recent/PYu-RC_Group_51_RoHS_L_7.pdf; Value: 10K
R2.2 R3.2 R4.2 R5.2 R6.2 R7.2 = RC0603FR-0710KL: as R1.1 on sheet [1]PowerSupply; Supplier 1: Digi-Key; Manufacturer Part Number: RC0603FR-0710KL; RoHS: RoHS Compliant; Category: Resistors; Stock 1: 16545228; Pricing 1: 1=0.1, 10=0.015, 100=0.006, 1000=0.00268, 2500=0.00233 (USD); Packaging: Cut Tape (CT); Part Status: Active; Composition: Thick Film; Features: Moisture Resistant; Operating Temperature: -55°C ~ 155°C; Package / Case: 0603 (1608 Metric); Supplier Device Package: 0603; Size / Dimension: 0.063" L x 0.032" W (1.60mm x 0.80mm); Height - Seated (Max): 0.022" (0.55mm); Failure Rate: -; ComponentLink1URL: http://www.yageo.com/documents/recent/PYu-RC_Group_51_RoHS_L_7.pdf; ComponentLink1Description: http://www.yageo.com/documents/recent/PYu-RC_Group_51_RoHS_L_7.pdf; Supplier Part Number 1: 311-10.0KHRCT-ND; Value: 10K
  R2.2 R4.2 R6.2 R7.2: Tolerance: ±1%
S1.2 S2.2 = EVQ-P9P02M: Switch Tactile N.O. SPST Rectangular Button J-Bend 0.02A 15VDC 5N SMD Embossed Tape and Reel; Manufacturer: Panasonic; Mechanical Life: 200000Cycles; Operating Force: 500gf; Illumination Type: Non-Illuminated; Max Voltage Rating (DC): 15V; Switch Travel: 0.25mm; Switch Function: Off-Mom; Contact Current Rating: 20mA; Number of Positions: 2; Supplier 1: Mouser; Manufacturer Part Number: EVQ-P9P02M; RoHS: No; Category: Tactile Switches; Stock 1: 5205; Pricing 1: 1=0.83, 10=0.734, 50=0.734, 100=0.61, 1000=0.5, 10000=0.402 (USD); Mount: Surface Mount; Case/Package: SMD/SMT; Min Operating Temperature: -40°C; Max Operating Temperature: 85°C; Package Quantity: 4000; Packaging: Tape and Reel; Throw Configuration: SPST; Termination: J-Bend; Series: EVQP9; Size: 3.5mm; Radiation Hardening: No; Lead Free: Lead Free; RoHS Compliant: No; ComponentLink1URL: https://datasheet.ciiva.com/29974/atv0000ce7-29974075.pdf?src-supplier=Avnet; ComponentLink1Description: https://datasheet.ciiva.com/29974/atv0000ce7-29974075.pdf?src-supplier=Avnet; ComponentLink2URL: https://datasheet.ciiva.com/14920/atv0000ce7-14920757.pdf?src-supplier=Digikey; ComponentLink2Description: https://datasheet.ciiva.com/14920/atv0000ce7-14920757.pdf?src-supplier=Digikey; ComponentLink3URL: https://datasheet.ciiva.com/14920/atv0000ce7-14920758.pdf?src-supplier=Digikey; ComponentLink3Description: https://datasheet.ciiva.com/14920/atv0000ce7-14920758.pdf?src-supplier=Digikey
U1.2 = STM32F103C8T6: STM32 ARM-based 32-bit MCU with 64 Kbytes Flash, 48-pin LQFP, Industrial Temperature; ComponentLink1URL: www.st.com/stm32; ComponentLink1Description: Manufacturer Link; Published: 30-May-2008; DatasheetVersion: rev6, Mar-2008; PackageVersion: Mar-2008; PackageReference: LQFP48; Publisher: Altium Limited; PackageDescription: 48-Pin Low-Profile Quad Flat Pack, 7 x 7 mm Body, 0.5 mm Pitch (LQFP48); ComponentLink2Description: Datasheet; ComponentLink2URL: http://www.st.com/stonline/products/literature/ds/13587.pdf

## Sheet [3] Sensors.SchDoc
size A4; SheetNumber: 3; SheetTotal: 3
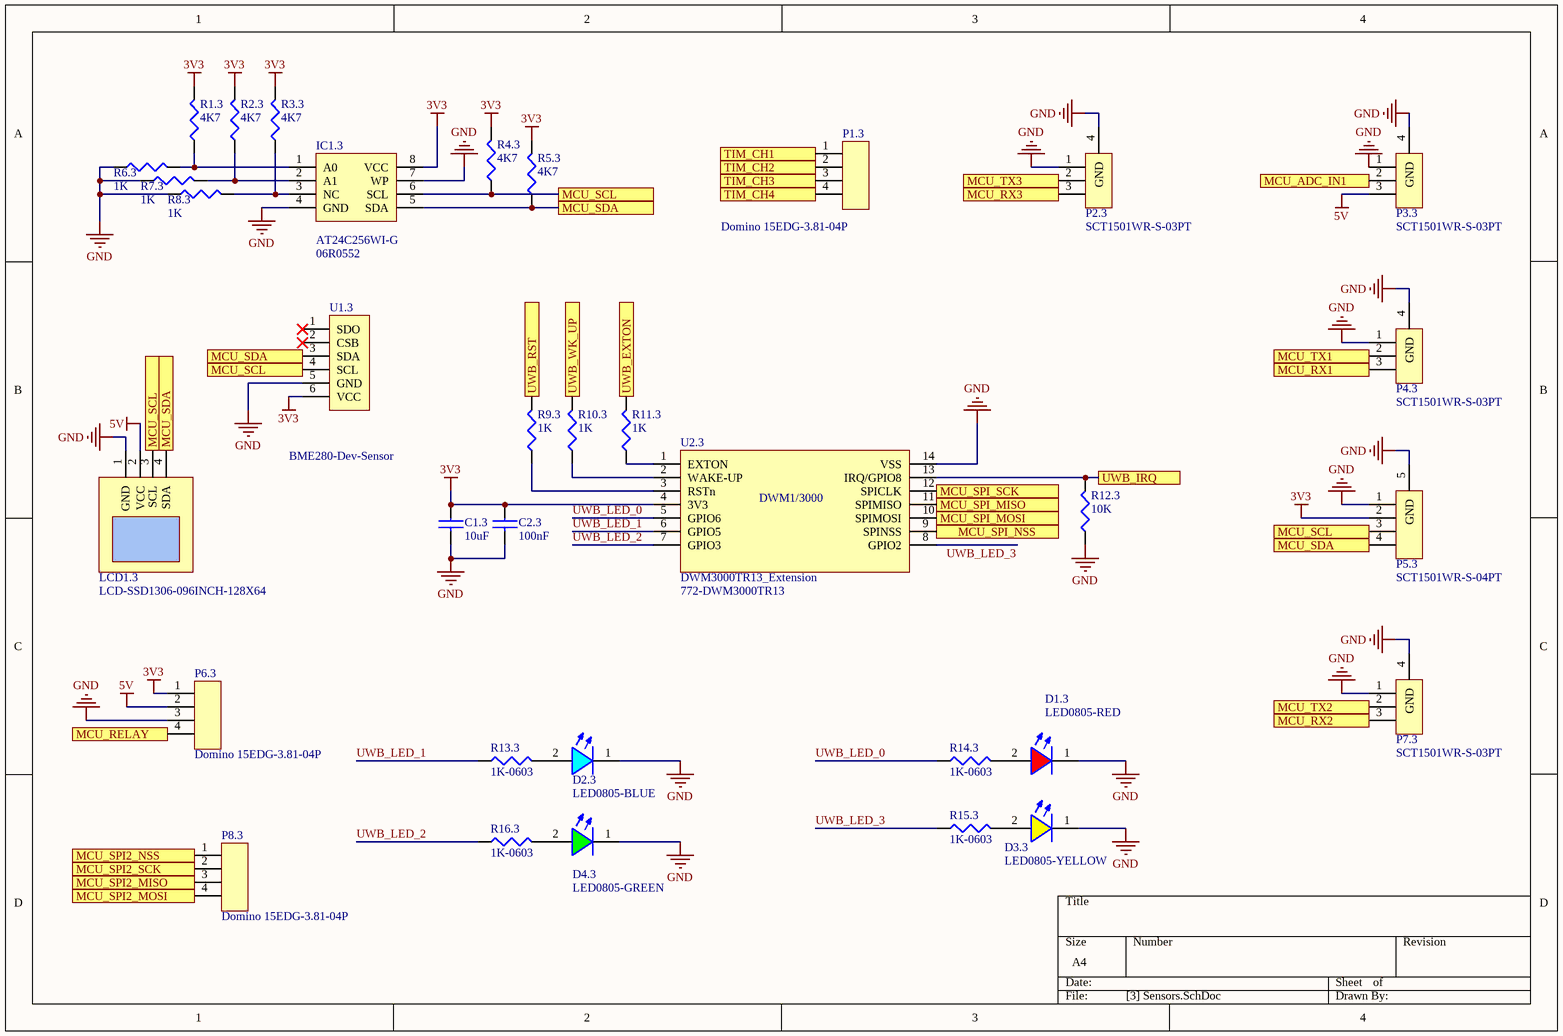
[diagram p2: [3] Sensors.SchDoc]

### Parts
C1.3  10uF  [CAP0603]
C2.3  100nF  [CAP0603]
D1.3  LED0805-RED  [LED0805-RED]
D2.3  LED0805-BLUE  [LED0805-BLUE]
D3.3  LED0805-YELLOW  [LED0805-YELLOW]
D4.3  LED0805-GREEN  [LED0805-GREEN]
IC1.3  AT24C256WI-G  Supplier Part Number 1: 06R0552  [SOP8]
LCD1.3  LCD-SSD1306-096INCH-128X64  [LCD128X64-SSD1306]
P1.3  Domino 15EDG-3.81-04P  [DOMINO 15EDG3.81 4P]
P2.3  SCT1501WR-S-03PT  [Connector ZH1.5 3P SMD]
P3.3  SCT1501WR-S-03PT  [Connector ZH1.5 3P SMD]
P4.3  SCT1501WR-S-03PT  [Connector ZH1.5 3P SMD]
P5.3  SCT1501WR-S-04PT  [Connector ZH1.5 4P SMD]
P6.3  Domino 15EDG-3.81-04P  [DOMINO 15EDG3.81 4P]
P7.3  SCT1501WR-S-03PT  [Connector ZH1.5 3P SMD]
P8.3  Domino 15EDG-3.81-04P  [DOMINO 15EDG3.81 4P]
R1.3  4K7  [RES0603 - 3D]
R2.3  4K7  [RES0603 - 3D]
R3.3  4K7  [RES0603 - 3D]
R4.3  4K7  [RES0603 - 3D]
R5.3  4K7  [RES0603 - 3D]
R6.3  1K  [RES0603 - 3D]
R7.3  1K  [RES0603 - 3D]
R8.3  1K  [RES0603 - 3D]
R9.3  1K  [RES0603 - 3D]
R10.3  1K  [RES0603 - 3D]
R11.3  1K  [RES0603 - 3D]
R12.3  10K  [RES0603 - 3D]
R13.3  1K-0603  [RES0603 - 3D]
R14.3  1K-0603  [RES0603 - 3D]
R15.3  1K-0603  [RES0603 - 3D]
R16.3  1K-0603  [RES0603 - 3D]
U1.3  BME280-Dev-Sensor  [bme280]
U2.3  DWM3000TR13_Extension  Supplier Part Number 1: 772-DWM3000TR13  [DWM3000-EXTEN-PAD]

### Ports
MCU_ADC_IN1, MCU_RELAY, MCU_RX1, MCU_RX2, MCU_RX3, MCU_SCL, MCU_SDA, MCU_SPI2_MISO, MCU_SPI2_MOSI, MCU_SPI2_NSS, MCU_SPI2_SCK, MCU_SPI_MISO, MCU_SPI_MOSI, MCU_SPI_NSS, MCU_SPI_SCK, MCU_TX1, MCU_TX2, MCU_TX3, TIM_CH1, TIM_CH2, TIM_CH3, TIM_CH4, UWB_EXTON, UWB_IRQ, UWB_RST, UWB_WK_UP

### Nets
3V3: C1.3.1 C2.3.1 IC1.3.8(VCC) P5.3.2 P6.3.1 R1.3.2 R2.3.2 R3.3.2 R4.3.2 R5.3.2 U1.3.6(VCC) U2.3.4(3V3)
5V: LCD1.3.2(VCC) P3.3.3 P6.3.2
GND: C1.3.2 C2.3.2 D1.3.1(+) D2.3.1(+) D3.3.1(+) D4.3.1(+) IC1.3.4(GND) IC1.3.7(WP) LCD1.3.1(GND) P2.3.1 P2.3.4(GND) P3.3.1 P3.3.4(GND) P4.3.1 P4.3.4(GND) P5.3.1 P5.3.5(GND) P6.3.3 P7.3.1 P7.3.4(GND) R6.3.1 R7.3.1 R8.3.1 R12.3.1 U1.3.5(GND) U2.3.14(VSS)
UWB_LED_0: R14.3.1 U2.3.5(GPIO6)
UWB_LED_1: R13.3.1 U2.3.6(GPIO5)
UWB_LED_2: R16.3.1 U2.3.7(GPIO3)
UWB_LED_3: R15.3.1 U2.3.8(GPIO2)
NetD1.3_2: D1.3.2(+) R14.3.2
NetD2.3_2: D2.3.2(+) R13.3.2
NetD3.3_2: D3.3.2(+) R15.3.2
NetD4.3_2: D4.3.2(+) R16.3.2
NetIC1.3_1: IC1.3.1(A0) R1.3.1 R6.3.2
NetIC1.3_2: IC1.3.2(A1) R2.3.1 R7.3.2
NetIC1.3_3: IC1.3.3(NC) R3.3.1 R8.3.2
NetIC1.3_5: IC1.3.5(SDA) LCD1.3.4(SDA) P5.3.4 R5.3.1 U1.3.3(SDA) ; port MCU_SDA
NetIC1.3_6: IC1.3.6(SCL) LCD1.3.3(SCL) P5.3.3 R4.3.1 U1.3.4(SCL) ; port MCU_SCL
NetP1.3_1: P1.3.1 ; port TIM_CH1
NetP1.3_2: P1.3.2 ; port TIM_CH2
NetP1.3_3: P1.3.3 ; port TIM_CH3
NetP1.3_4: P1.3.4 ; port TIM_CH4
NetP2.3_2: P2.3.2 ; port MCU_TX3
NetP2.3_3: P2.3.3 ; port MCU_RX3
NetP3.3_2: P3.3.2 ; port MCU_ADC_IN1
NetP4.3_2: P4.3.2 ; port MCU_TX1
NetP4.3_3: P4.3.3 ; port MCU_RX1
NetP6.3_4: P6.3.4 ; port MCU_RELAY
NetP7.3_2: P7.3.2 ; port MCU_TX2
NetP7.3_3: P7.3.3 ; port MCU_RX2
NetP8.3_1: P8.3.1 ; port MCU_SPI2_NSS
NetP8.3_2: P8.3.2 ; port MCU_SPI2_SCK
NetP8.3_3: P8.3.3 ; port MCU_SPI2_MISO
NetP8.3_4: P8.3.4 ; port MCU_SPI2_MOSI
NetR9.3_1: R9.3.1 U2.3.3(RSTn)
NetR9.3_2: R9.3.2 ; port UWB_RST
NetR10.3_1: R10.3.1 U2.3.2(WAKE-UP)
NetR10.3_2: R10.3.2 ; port UWB_WK_UP
NetR11.3_1: R11.3.1 U2.3.1(EXTON)
NetR11.3_2: R11.3.2 ; port UWB_EXTON
NetR12.3_2: R12.3.2 U2.3.13(IRQ/GPIO8) ; port UWB_IRQ
NetU1.2_14: U2.3.9(SPINSS) ; port MCU_SPI_NSS
NetU1.2_15: U2.3.12(SPICLK) ; port MCU_SPI_SCK
NetU1.2_16: U2.3.11(SPIMISO) ; port MCU_SPI_MISO
NetU1.2_17: U2.3.10(SPIMOSI) ; port MCU_SPI_MOSI

Not connected (* = marked no-connect by the designer): U1.3 1(SDO)* 2(CSB)*

### Notes on the sheet
- (in symbol DWM3000TR13_Extension) DWM1/3000

### Library data of the parts
C1.3 = CC0603KRX5R6BB106: CAP CER 10UF 10V X5R 0603; Manufacturer 1: Yageo; Category 1: Capacitors; Capacitance: 10µF; Tolerance: ±10%; Supplier 1: Digi-Key; Supplier Part Number 1: 311-1782-1-ND; Manufacturer Part Number 1: CC0603KRX5R6BB106; RoHS 1: RoHS Compliant; Description 1: CAP CER 10UF 10V X5R 0603; Stock 1: 66566; Pricing 1: 1=0.33, 10=0.225, 100=0.1272, 500=0.08982, 1000=0.07858 (USD); Packaging: Cut Tape (CT); Part Status: Active; Voltage - Rated: 10V; Temperature Coefficient: X5R; Operating Temperature: -55°C ~ 85°C; Features: -; Ratings: -; Applications: General Purpose; Failure Rate: -; Mounting Type: Surface Mount, MLCC; Package / Case: 0603 (1608 Metric); Size / Dimension: 0.063" L x 0.031" W (1.60mm x 0.80mm); Height - Seated (Max): -; Thickness (Max): 0.035" (0.90mm); Lead Spacing: -; Lead Style: -; ComponentLink1URL: http://www.yageo.com/documents/recent/UPY-GPHC_X5R_4V-to-50V_24.pdf; ComponentLink1Description: http://www.yageo.com/documents/recent/UPY-GPHC_X5R_4V-to-50V_24.pdf; Value: 10uF
C2.3 = CC0603KRX7R0BB104: CAP CER 0.1UF 100V X7R 0603; Manufacturer: Yageo; Tolerance: ±10%; Supplier 1: Digi-Key; Manufacturer Part Number: CC0603KRX7R0BB104; RoHS: RoHS Compliant; Category: Capacitors; Stock 1: 784508; Pricing 1: 1=0.23, 10=0.156, 100=0.0791, 500=0.05414, 1000=0.0479 (USD); Packaging: Cut Tape (CT); Part Status: Active; Temperature Coefficient: X7R; Operating Temperature: -55°C ~ 125°C; Features: -; Ratings: -; Applications: General Purpose; Failure Rate: -; Mounting Type: Surface Mount, MLCC; Package / Case: 0603 (1608 Metric); Size / Dimension: 0.063" L x 0.032" W (1.60mm x 0.80mm); Height - Seated (Max): -; Thickness (Max): 0.035" (0.90mm); Lead Spacing: -; Lead Style: -; ComponentLink1URL: http://media.digikey.com/pdf/Data%20Sheets/Yageo%20PDFs/NPO,%20X7R%20Mid-voltage.pdf; ComponentLink1Description: http://media.digikey.com/pdf/Data%20Sheets/Yageo%20PDFs/NPO,%20X7R%20Mid-voltage.pdf; Supplier Part Number 1: 311-1523-1-ND; Value: 100nF; Voltage - Rated: 100V
IC1.3 = AT24C256WI-G: CAT24C256 Series 256 Kb (32K X 8)  1.8 V - 5.5 V I2C CMOS Serial EEPROM - SOIC-8; Manufacturer: ON Semiconductor; Manufacturer Part Number: CAT24C256WI-G; Frequency: 400kHz; Access Time: 500ns; Memory Size: 256Kb; Interface: I2C,Serial; Max Supply Voltage: 5.5V; Min Supply Voltage: 1.8V; Memory Type: Non-Volatile,EEPROM; Max Frequency: 100kHz; Nominal Supply Current: 3mA; Access Time-Max: 900ns; Organization: 32KX8; Write Protection: YES; Operating Supply Voltage: 5V; Write Cycle Time-Max (tWC): 5ms; Supplier 1: Newark; RoHS: Yes; Category: EEPROM; Mount: Surface Mount; Case/Package: SOIC; Number of Pins: 8; Contact Plating: Gold; Min Operating Temperature: -40°C; Max Operating Temperature: 85°C; Packaging: Rail/Tube; Package Quantity: 100; Series: -; Density: 256Kb; Supply Current: 3mA; Supply Voltage-Nom: 5.5V; Radiation Hardening: No; Lead Free: Lead Free; RoHS Compliant: Yes; Reach SVHC Compliant: Yes; ComponentLink1URL: https://datasheet.ciiva.com/1166/cat24c256-d-1166416.pdf?src-supplier=Newark; ComponentLink1Description: https://datasheet.ciiva.com/1166/cat24c256-d-1166416.pdf?src-supplier=Newark; ComponentLink2URL: https://datasheet.ciiva.com/15123/getdatasheetpartid-257691-15123320.pdf?src-supplier=Verical; ComponentLink2Description: https://datasheet.ciiva.com/15123/getdatasheetpartid-257691-15123320.pdf?src-supplier=Verical; ComponentLink3URL: https://datasheet.ciiva.com/5700/cat24c256-d-5700793.pdf?src-supplier=Farnell; ComponentLink3Description: https://datasheet.ciiva.com/5700/cat24c256-d-5700793.pdf?src-supplier=Farnell; ComponentLink4URL: https://datasheet.ciiva.com/8072/cat24c256-d-8072141.pdf?src-supplier=Element14; ComponentLink4Description: https://datasheet.ciiva.com/8072/cat24c256-d-8072141.pdf?src-supplier=Element14; ComponentLink5URL: https://datasheet.ciiva.com/4859/cat24c256-d-105771-4859399.pdf?src-supplier=Mouser; ComponentLink5Description: https://datasheet.ciiva.com/4859/cat24c256-d-105771-4859399.pdf?src-supplier=Mouser; ComponentLink6URL: https://datasheet.ciiva.com/3185/cat24c256-d-3185116.pdf?src-supplier=Avnet; ComponentLink6Description: https://datasheet.ciiva.com/3185/cat24c256-d-3185116.pdf?src-supplier=Avnet; ComponentLink7URL: https://datasheet.ciiva.com/16456/cat24c256-d-16456381.pdf?src-supplier=Future+Electronics; ComponentLink7Description: https://datasheet.ciiva.com/16456/cat24c256-d-16456381.pdf?src-supplier=Future+Electronics; ComponentLink8URL: https://datasheet.ciiva.com/1912/cat24c256-d-1912247.pdf?src-supplier=Digi-Key; ComponentLink8Description: https://datasheet.ciiva.com/1912/cat24c256-d-1912247.pdf?src-supplier=Digi-Key
R1.3 R2.3 R3.3 R4.3 R5.3 = RC0603JR-074K7L: RES SMD 4.7K OHM 5% 1/10W 0603; Manufacturer: Yageo; Power (Watts): 0.1W, 1/10W; Temperature Coefficient: ±100ppm/°C; Supplier 1: Digi-Key; Manufacturer Part Number: RC0603JR-074K7L; RoHS: RoHS Compliant; Category: Resistors; Stock 1: 4925196; Pricing 1: 1=0.1, 10=0.011, 100=0.0046, 1000=0.00207, 2500=0.0018 (USD); Packaging: Cut Tape (CT); Part Status: Active; Tolerance: ±5%; Composition: Thick Film; Features: Moisture Resistant; Operating Temperature: -55°C ~ 155°C; Package / Case: 0603 (1608 Metric); Supplier Device Package: 0603; Size / Dimension: 0.063" L x 0.032" W (1.60mm x 0.80mm); Height - Seated (Max): 0.022" (0.55mm); Failure Rate: -; ComponentLink1URL: http://www.yageo.com/documents/recent/PYu-RC_Group_51_RoHS_L_7.pdf; ComponentLink1Description: http://www.yageo.com/documents/recent/PYu-RC_Group_51_RoHS_L_7.pdf; Supplier Part Number 1: 311-4.7KGRCT-ND; Value: 4K7
R6.3 R7.3 R8.3 R9.3 R10.3 R11.3 R13.3 R14.3 R15.3 R16.3 = RC0603JR-071KL: as R2.1 on sheet [1]PowerSupply; Supplier 1: Digi-Key; Supplier Part Number 1: 311-1.0KGRCT-ND; Manufacturer Part Number 1: RC0603JR-071KL; RoHS 1: RoHS Compliant; Description 1: RES SMD 1K OHM 5% 1/10W 0603; Stock 1: 2853955; Pricing 1: 1=0.1, 10=0.011, 100=0.0044, 1000=0.00198, 2500=0.00172 (USD); Packaging: Cut Tape (CT); Part Status: Active; Resistance (Ohms): 1k; Tolerance: ±5%; Composition: Thick Film; Features: Moisture Resistant; Operating Temperature: -55°C ~ 155°C; Package / Case: 0603 (1608 Metric); Supplier Device Package: 0603; Size / Dimension: 0.063" L x 0.031" W (1.60mm x 0.80mm); Height - Seated (Max): 0.022" (0.55mm); Failure Rate: -; ComponentLink1URL: http://www.yageo.com/documents/recent/PYu-RC_Group_51_RoHS_L_7.pdf; ComponentLink1Description: http://www.yageo.com/documents/recent/PYu-RC_Group_51_RoHS_L_7.pdf; Value: 1K
R12.3 = RC0603JR-0710KL: as R1.2 on sheet [2] MicroController; Supplier 1: Digi-Key; Supplier Part Number 1: 311-10KGRCT-ND; Manufacturer Part Number 1: RC0603JR-0710KL; RoHS 1: RoHS Compliant; Description 1: RES SMD 10K OHM 5% 1/10W 0603; Stock 1: 3056463; Pricing 1: 1=0.1, 10=0.011, 100=0.0044, 1000=0.00198, 2500=0.00172 (USD); Packaging: Cut Tape (CT); Part Status: Active; Resistance (Ohms): 10k; Tolerance: ±5%; Composition: Thick Film; Features: Moisture Resistant; Operating Temperature: -55°C ~ 155°C; Package / Case: 0603 (1608 Metric); Supplier Device Package: 0603; Size / Dimension: 0.063" L x 0.031" W (1.60mm x 0.80mm); Height - Seated (Max): 0.022" (0.55mm); Failure Rate: -; ComponentLink1URL: http://www.yageo.com/documents/recent/PYu-RC_Group_51_RoHS_L_7.pdf; ComponentLink1Description: http://www.yageo.com/documents/recent/PYu-RC_Group_51_RoHS_L_7.pdf; Value: 10K
U2.3 = DWM3000TR13_Extension: UWB Transceiver Module; Manufacturer: Qorvo; Supplier 1: Mouser; Manufacturer Part Number: DWM3000TR13; RoHS: Yes; Category: RF Receivers, Transceivers; Stock 1: 12093; Pricing 1: 1=23.62, 10=23.62, 50=20.19, 100=17.18, 1000=12.71, 10000=12.71 (USD)

## Nets that join several sheets
3V3: [1]PowerSupply (C4.1.1 IC1.1.2 IC1.1.4), [2] MicroController (14 pins), [3] Sensors (12 pins)
5V: [1]PowerSupply (6 pins), [2] MicroController (B1.2.1), [3] Sensors (LCD1.3.2 P3.3.3 P6.3.2)
GND: [1]PowerSupply (14 pins), [2] MicroController (23 pins), [3] Sensors (26 pins)
NetIC1.3_5: [2] MicroController (U1.2.46), [3] Sensors (5 pins)
NetIC1.3_6: [2] MicroController (U1.2.45), [3] Sensors (5 pins)
NetP1.1_2: [1]PowerSupply (P1.1.2), [2] MicroController (U1.2.10)
NetP1.3_1: [2] MicroController (U1.2.29), [3] Sensors (P1.3.1)
NetP1.3_2: [2] MicroController (U1.2.30), [3] Sensors (P1.3.2)
NetP1.3_3: [2] MicroController (U1.2.31), [3] Sensors (P1.3.3)
NetP1.3_4: [2] MicroController (U1.2.32), [3] Sensors (P1.3.4)
NetP2.3_2: [2] MicroController (U1.2.21), [3] Sensors (P2.3.2)
NetP2.3_3: [2] MicroController (U1.2.22), [3] Sensors (P2.3.3)
NetP3.3_2: [2] MicroController (U1.2.11), [3] Sensors (P3.3.2)
NetP4.3_2: [2] MicroController (U1.2.42), [3] Sensors (P4.3.2)
NetP4.3_3: [2] MicroController (U1.2.43), [3] Sensors (P4.3.3)
NetP6.3_4: [2] MicroController (U1.2.33), [3] Sensors (P6.3.4)
NetP7.3_2: [2] MicroController (U1.2.12), [3] Sensors (P7.3.2)
NetP7.3_3: [2] MicroController (U1.2.13), [3] Sensors (P7.3.3)
NetP8.3_1: [2] MicroController (U1.2.25), [3] Sensors (P8.3.1)
NetP8.3_2: [2] MicroController (U1.2.26), [3] Sensors (P8.3.2)
NetP8.3_3: [2] MicroController (U1.2.27), [3] Sensors (P8.3.3)
NetP8.3_4: [2] MicroController (U1.2.28), [3] Sensors (P8.3.4)
NetR9.3_2: [2] MicroController (U1.2.39), [3] Sensors (R9.3.2)
NetR10.3_2: [2] MicroController (U1.2.40), [3] Sensors (R10.3.2)
NetR11.3_2: [2] MicroController (U1.2.41), [3] Sensors (R11.3.2)
NetR12.3_2: [2] MicroController (U1.2.18), [3] Sensors (R12.3.2 U2.3.13)
NetU1.2_14: [2] MicroController (U1.2.14), [3] Sensors (U2.3.9)
NetU1.2_15: [2] MicroController (U1.2.15), [3] Sensors (U2.3.12)
NetU1.2_16: [2] MicroController (U1.2.16), [3] Sensors (U2.3.11)
NetU1.2_17: [2] MicroController (U1.2.17), [3] Sensors (U2.3.10)